# Altium schematic sheet Starter.SchDoc
size A4; SheetNumber: 7; SheetTotal: 7
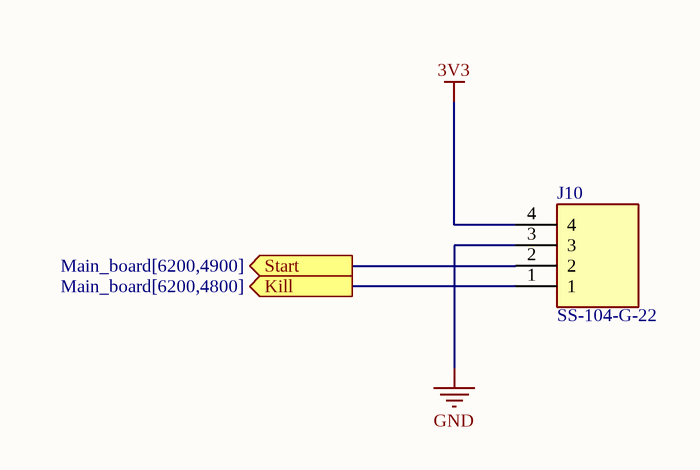
[diagram p0: Starter.SchDoc]

## Parts
J10  SS-104-G-22  [PCB 4 PIN PADS]

## Ports
Kill (out, see Main_board[6200,4800]), Start (out, see Main_board[6200,4900])

## Nets
3V3: J10.4
GND: J10.3
Kill: J10.1 ; port Kill
Start: J10.2 ; port Start

## Library data of the parts
J10 = SS-104-G-22: Connector; Manufacturer_Name: SAMTEC; Datasheet Link: http://suddendocs.samtec.com/prints/sx-1xx-xx-xx-x-x-mkt.pdf; Height: 4.44mm; Manufacturer_Part_Number: SS-104-G-22